# EasyEDA Pro project 1 Port AC Power Switch.eprj, schematic with Blown Fuse Detect
Board Name: V3.0.1; Create Date: 2026-05-01; Page Name: Main Page; Project Name: 1 Port AC Power Switch; Schematic Name: with Blown Fuse Detect; Update Date: 2026-05-01
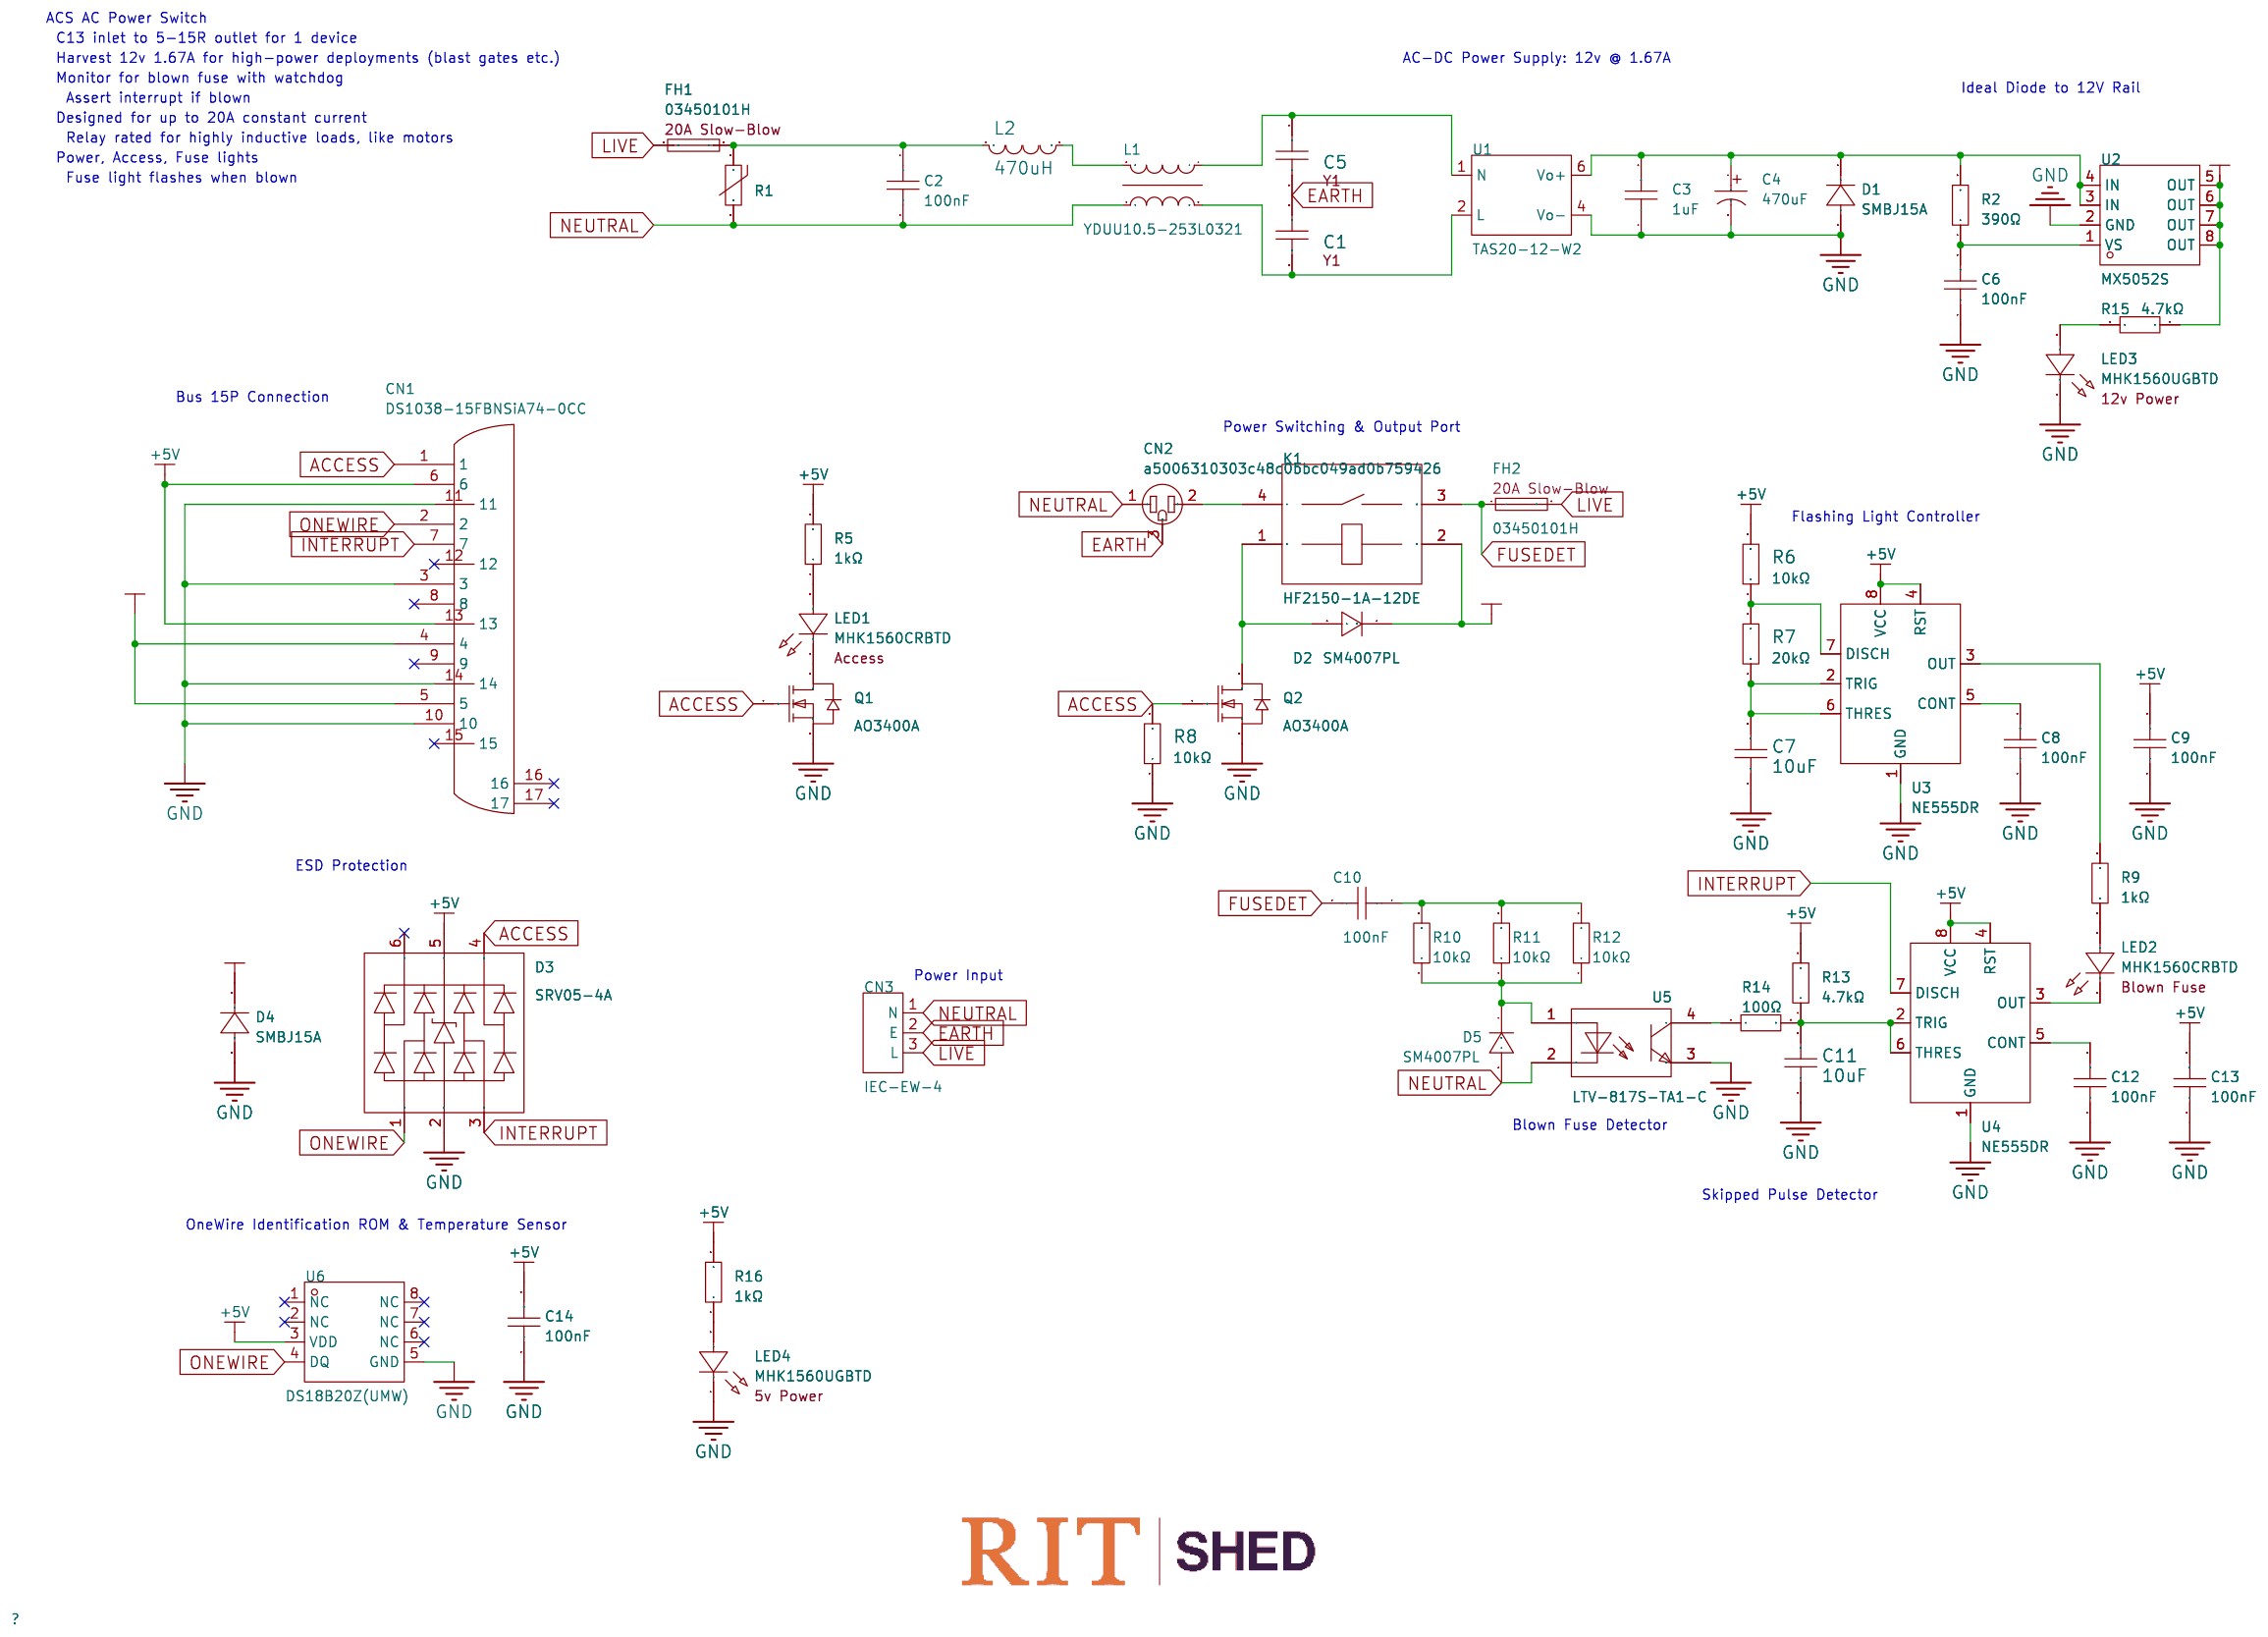
[diagram p1: schematic sheet]

## Parts
C1  1nF  [CAP-TH_L8.5-W5.0-P10.00-D0.6]
C2  100nF  [CAP-TH_L10.0-W5.0-P7.50-D0.6]
C3  1uF  [C0603]
C4  470uF  [CAP-TH_BD10.0-P5.00-D1.0-FD]
C5  1nF  [CAP-TH_L8.5-W5.0-P10.00-D0.6]
C6  100nF  [C0603]
C7  10uF  [C0603]
C8  100nF  [C0603]
C9  100nF  [C0603]
C10  100nF  [CAP-TH_L10.0-W5.0-P7.50-D0.6]
C11  10uF  [C0603]
C12  100nF  [C0603]
C13  100nF  [C0603]
C14  100nF  [C0603]
CN1  DS1038-15FBNSiA74-0CC  [DSUB-TH_DS1038-15FBNSIA74-0CC]
CN2  a5006310303c48c0bbc049ad0b759426  [739W-X2/32]
CN3  IEC-EW-4  [CONN-TH_IEC-EW-4]
D1  SMBJ15A  [SMB_L4.3-W3.6-LS5.3-RD]
D2  SM4007PL  [SOD-123F_L2.8-W1.8-LS3.7-RD]
D3  SRV05-4A  [SOT-23-6_L2.9-W1.6-P0.95-LS2.9-BL]
D4  SMBJ15A  [SMB_L4.3-W3.6-LS5.3-RD]
D5  SM4007PL  [SOD-123F_L2.8-W1.8-LS3.7-RD]
FH1  03450101H  [03450101H]
FH2  03450101H  [03450101H]
K1  HF2150-1A-12DE  [RELAY-TH_HF2150-1A]
L1  YDUU10.5-253L0321  [IND-TH_4P-L19.0-W17.0]
L2  470uH  [IND-TH_BD9.0-P5.00-D0.7]
LED1  MHK1560CRBTD  [LED-TH_MHK1560UGBTD]
LED2  MHK1560CRBTD  [LED-TH_MHK1560UGBTD]
LED3  MHK1560UGBTD  [LED-TH_MHK1560UGBTD]
LED4  MHK1560UGBTD  [LED-TH_MHK1560UGBTD]
Q1  AO3400A  [SOT-23-3_L2.9-W1.3-P1.90-LS2.4-BR]
Q2  AO3400A  [SOT-23-3_L2.9-W1.3-P1.90-LS2.4-BR]
R1  210pF@1kHz  [RES-TH_L12.5-W5.1-P7.50-D1.2-S2.20]
R2  390Ω  [R0805]
R5  1kΩ  [R0603]
R6  10kΩ  [R0603]
R7  20kΩ  [R0603]
R8  10kΩ  [R0603]
R9  1kΩ  [R0603]
R10  10kΩ  [R0805]
R11  10kΩ  [R0805]
R12  10kΩ  [R0805]
R13  4.7kΩ  [R0603]
R14  100Ω  [R0603]
R15  4.7kΩ  [R0603]
R16  1kΩ  [R0603]
U1  TAS20-12-W2  [PWRM-TH_4P-L39.0-W25.0_TAS12-15-W2]
U2  MX5052S  [SOP-8_L4.9-W3.9-P1.27-LS6.0-BL]
U3  NE555DR  [SOIC-8_L4.9-W3.9-P1.27-LS6.0-BL]
U4  NE555DR  [SOIC-8_L4.9-W3.9-P1.27-LS6.0-BL]
U5  LTV-817S-TA1-C  [OPTO-SMD-4_L4.6-W6.5-P2.54-LS10.3-BL]
U6  DS18B20Z(UMW)  [SOP-8_L4.9-W3.9-P1.27-LS6.0-BL]

## Library data of the parts
C1 C5 = VY1102M31Y5UC63V0: LCSC Part Name: 等级:X1,Y1 1nF ±20% 760V; Supplier Part: C1620957; Manufacturer: VISHAY(威世); Supplier Footprint: 插件,P=10mm; JLCPCB Part Class: Extended Part; Datasheet: https://item.szlcsc.com/datasheet/VY1102M31Y5UC63V0/1711803.html; Supplier: LCSC; Tolerance: ±20%; Voltage(AC): 760V; Ratings: Y1; Operating Temperature: -40℃~+125℃
C2 C10 = PX104K2C0702: LCSC Part Name: 等级:X2 100nF ±10% 310V 350V 380V; Supplier Part: C2693793; Manufacturer: KYET(科雅); Supplier Footprint: 插件,P=7.5mm; JLCPCB Part Class: Extended Part; Datasheet: https://item.szlcsc.com/datasheet/PX104K2C0702/2809868.html; Supplier: LCSC; Tolerance: ±10%; Voltage(AC): 310V；380V；350V; Ratings: X2; Operating Temperature: -40℃~+110℃
C3 = CL10A105KB8NNNC: LCSC Part Name: 1uF ±10% 50V; Supplier Part: C15849; Manufacturer: SAMSUNG(三星); Supplier Footprint: 0603; JLCPCB Part Class: Basic Part; Datasheet: https://item.szlcsc.com/datasheet/CL10A105KB8NNNC/16531.html; Supplier: LCSC; Tolerance: ±10%; Voltage Rating: 50V; Temperature Coefficient: X5R
C4 = KM477M025G13RR0VH2FP0: LCSC Part Name: 470uF ±20% 25V; Supplier Part: C44594; Manufacturer: Chengx(承兴); Supplier Footprint: 插件,D10xL13mm; JLCPCB Part Class: Extended Part; Datasheet: https://item.szlcsc.com/datasheet/KM477M025G13RR0VH2FP0/45596.html; Supplier: LCSC; Tolerance: ±20%; Voltage Rating: 25V; Pin Spacing: 5mm; Diameter: 10mm; Height - Seated (Max): 13mm; Lifetime: 2000hrs@105℃
C6 C8 C9 C12-C14 = CC0603KRX7R9BB104: LCSC Part Name: 100nF ±10% 50V; Supplier Part: C14663; Manufacturer: YAGEO(国巨); Supplier Footprint: 0603; Datasheet: https://item.szlcsc.com/datasheet/CC0603KRX7R9BB104/15331.html; Supplier: LCSC; Tolerance: ±10%; Voltage Rating: 50V; Temperature Coefficient: X7R
C7 C11 = CL10A106MA8NRNC: LCSC Part Name: 10uF ±20% 25V; Supplier Part: C96446; Manufacturer: SAMSUNG(三星); Supplier Footprint: 0603; Datasheet: https://item.szlcsc.com/datasheet/CL10A106MA8NRNC/97651.html; Supplier: LCSC; Tolerance: ±20%; Voltage Rating: 25V; Temperature Coefficient: X5R
CN1 = DS1038-15FBNSiA74-0CC: Connector Type:High Density D-Sub Gender:Female Number of Pins:15P Mounting Type:Right Angle Number of Rows:3 Current Rating-Signal:3A Current Rating-Power:- Voltage Rating:- Color:Black Operating Temperature:-40℃~+105℃ Operating Temperature:-40℃~+105℃; LCSC Part Name: 黑色 1000/盒 D-Sub 母 P数:15P; Supplier Part: C75754; Manufacturer: CONNFLY; Supplier Footprint: 弯插; JLCPCB Part Class: Extended Part; Datasheet: https://item.szlcsc.com/datasheet/DS1038-15FBNSiA74-0CC/76880.html; Supplier: LCSC; Connector Type: High Density D-Sub; Gender: Female; Number of Pins: 15P; Mounting Type: Right Angle; Number of Rows: 3; Current Rating-Signal: 3A; Color: Black; Operating Temperature: -40℃~+105℃
CN2 = 739W-X2/32
CN3 = IEC-EW-4: Supplier Part: C17684530; Manufacturer: ADAM TECH; Datasheet: https://item.szlcsc.com/datasheet/IEC-EW-4/18813803.html; Supplier: LCSC
D1 D4 = SMBJ15A_C19077569: LCSC Part Name: 单向TVS 15V截止 峰值浪涌电流：24.59A@10/1000us; Supplier Part: C19077569; Manufacturer: R+O(宏嘉诚); Supplier Footprint: DO-214AA(SMB); JLCPCB Part Class: Extended Part; Datasheet: https://item.szlcsc.com/datasheet/SMBJ15A/20275654.html; Supplier: LCSC; Polarity: Unidirectional; Reverse Stand-Off Voltage (Vrwm): 15V; Clamping Voltage: 24.4V; Peak Pulse Current (Ipp): 24.59A@10/1000us; Peak Pulse Power Dissipation (Ppp): 600W@10/1000us; Voltage - Breakdown: 18.5V; Reverse Leakage Current (Ir): 5uA; Operating Temperature: -55℃~+150℃; level of protection: IEC 61000-4-2; Type: TVS
D2 D5 = SM4007PL_C64898: LCSC Part Name: 1kV 1A; Supplier Part: C64898; Manufacturer: MDD(辰达半导体); Supplier Footprint: SOD-123FL; Datasheet: https://item.szlcsc.com/datasheet/SM4007PL/65968.html; Supplier: LCSC; Diode Configuration: Independent; Voltage - Forward(Vf@If): 1.1V@1A; Voltage - DC Reverse(Vr): 1kV; Current - Rectified: 1A; Reverse Leakage Current (Ir): 10uA@1kV; Non-Repetitive Peak Forward Surge Current: 25A; Operating Junction Temperature Range: -55℃~+150℃
D3 = SRV05-4A_C20615829: LCSC Part Name: 丝印:V05 单向ESD 5V截止 峰值浪涌电流：4A@8/20us; Supplier Part: C20615829; Manufacturer: R+O(宏嘉诚); Supplier Footprint: SOT-23-6L; JLCPCB Part Class: Extended Part; Datasheet: https://item.szlcsc.com/datasheet/SRV05-4A/21980004.html; Supplier: LCSC; Polarity: Unidirectional; Reverse Stand-Off Voltage (Vrwm): 5V; Clamping Voltage: 15V; Peak Pulse Current (Ipp): 4A@8/20us; Peak Pulse Power Dissipation (Ppp): 80W@8/20us; Voltage - Breakdown: 6V; Reverse Leakage Current (Ir): 5uA; Operating Temperature: -55℃~+155℃; level of protection: IEC 61000-4-5；IEC 61000-4-2; Type: ESD; Junction Capacitance: 0.5pF；1pF
FH1 FH2 = 03450101H: LCSC Part Name: 20A 600V; Supplier Part: C206934; Manufacturer: Littelfuse(美国力特); Datasheet: https://item.szlcsc.com/datasheet/03450101H/208053.html; Supplier: LCSC; Number of Circuits: 1; Voltage Rating: 600V; Current Rating: 20A; Fuse Type: Cylindrical; Fuse Diameter (φD): 6.35mm; Fuse Length: 32mm; Note: 20A Slow-Blow
K1 = HF2150-1A-12DE: LCSC Part Name: 小型大功率12V继电器 单刀单掷-常开; Supplier Part: C32863; Manufacturer: HF(宏发); Supplier Footprint: 插件,31.8x27mm; JLCPCB Part Class: Extended Part; Datasheet: https://item.szlcsc.com/datasheet/HF2150-1A-12DE/33828.html; Supplier: LCSC; Coil Voltage: 12V; Contact Form: 1 Set Normally Open: 1A (SPST NO); Number of Pins: 5; Contact Rating: 30A@240VAC；20A@30VDC; Switching Voltage(Max): 277V@AC；30V@DC; Coil Rated Power: 900mW; Contact Material: AgCdO; Switching Current(Max): 40A; Coil Type: Non-Polarized - Single Coil; Coil Resistance: 155Ω; Contact Resistance: 50mΩ; Operate Time: 15ms; Release Time: 10ms; Operating Temperature: -55℃~+85℃
L1 = YDUU10.5-253L0321: LCSC Part Name: UU10.5 25mH @1KHz; Supplier Part: C5200263; Manufacturer: YJYCOIN(益嘉源); Supplier Footprint: 插件,19x17mm; JLCPCB Part Class: Extended Part; Datasheet: https://item.szlcsc.com/datasheet/YDUU10.5-253L0321/5887401.html; Supplier: LCSC; Number of Lines: 2; Inductance @ Frequency: 25mH@1KHz; Voltage Withstand: 1.5kV@AC
L2 = PK0810-471MB: LCSC Part Name: 470uH ±20%; Supplier Part: C400319; Manufacturer: SXN(顺翔诺); Supplier Footprint: 插件,D10xL13mm; JLCPCB Part Class: Extended Part; Datasheet: https://item.szlcsc.com/datasheet/PK0810-471MB/384150.html; Supplier: LCSC; Tolerance: ±20%; Current Rating: 420mA; DC Resistance(DCR): 800mΩ; Type: Unshielded Inductor
LED1 = MHK1560CRBTD: LCSC Part Name: 1560直插单灯红色光; Supplier Part: C7470835; Manufacturer: MEIHUA(美华); Supplier Footprint: 插件,P=2.54mm; JLCPCB Part Class: Extended Part; Datasheet: https://item.szlcsc.com/datasheet/MHK1560CRBTD/8521940.html; Supplier: LCSC; Illumination Color: Red; Voltage - Forward(Vf): 1.75V~2.2V; Power(Watts): 80mW; Forward Current: 20mA; Wavelength - Dominant: 632nm; Lens Color: Diffused Red Lens; Luminous Intensity: 50mcd; Viewing Angle: 85°; Operating Temperature: -40℃~+85℃; Note: Access
LED2 = MHK1560CRBTD: LCSC Part Name: 1560直插单灯红色光; Supplier Part: C7470835; Manufacturer: MEIHUA(美华); Supplier Footprint: 插件,P=2.54mm; JLCPCB Part Class: Extended Part; Datasheet: https://item.szlcsc.com/datasheet/MHK1560CRBTD/8521940.html; Supplier: LCSC; Illumination Color: Red; Voltage - Forward(Vf): 1.75V~2.2V; Power(Watts): 80mW; Forward Current: 20mA; Wavelength - Dominant: 632nm; Lens Color: Diffused Red Lens; Luminous Intensity: 50mcd; Viewing Angle: 85°; Operating Temperature: -40℃~+85℃; Note: Blown Fuse
LED3 = MHK1560UGBTD: Emitted Color:Emerald Forward Voltage (VF):1.75V~2.2V Forward Voltage (VF):1.75V~2.2V Forward Current:20mA Dominant Wavelength:520nm Dominant Wavelength:520nm Lens Color:雾状绿透镜 Luminous Intensity:1000mcd Luminous Intensity:1000mcd Viewing Angle:85° Operati; LCSC Part Name: 1560直插单灯翠绿色光; Supplier Part: C7470833; Manufacturer: MEIHUA(美华); Supplier Footprint: 插件,P=2.54mm; JLCPCB Part Class: Extended Part; Datasheet: https://atta.szlcsc.com/upload/public/pdf/source/20231114/0151DB1F997DCF286213A722D08B4BAA.pdf; Supplier: LCSC; Emitted Color: Emerald; Forward Voltage (VF): 1.75V~2.2V; Forward Current: 20mA; Dominant Wavelength: 520nm; Lens Color: 雾状绿透镜; Luminous Intensity: 1000mcd; Viewing Angle: 85°; Operating Temperature: -40℃~+85℃; Note: 12v Power
LED4 = MHK1560UGBTD: Emitted Color:Emerald Forward Voltage (VF):1.75V~2.2V Forward Voltage (VF):1.75V~2.2V Forward Current:20mA Dominant Wavelength:520nm Dominant Wavelength:520nm Lens Color:雾状绿透镜 Luminous Intensity:1000mcd Luminous Intensity:1000mcd Viewing Angle:85° Operati; LCSC Part Name: 1560直插单灯翠绿色光; Supplier Part: C7470833; Manufacturer: MEIHUA(美华); Supplier Footprint: 插件,P=2.54mm; JLCPCB Part Class: Extended Part; Datasheet: https://atta.szlcsc.com/upload/public/pdf/source/20231114/0151DB1F997DCF286213A722D08B4BAA.pdf; Supplier: LCSC; Emitted Color: Emerald; Forward Voltage (VF): 1.75V~2.2V; Forward Current: 20mA; Dominant Wavelength: 520nm; Lens Color: 雾状绿透镜; Luminous Intensity: 1000mcd; Viewing Angle: 85°; Operating Temperature: -40℃~+85℃; Note: 5v Power
Q1 Q2 = AO3400A_C20917: LCSC Part Name: 1个N沟道 耐压:30V 电流:5.7A; Supplier Part: C20917; Manufacturer: AOS; Supplier Footprint: SOT-23-3L; Datasheet: https://item.szlcsc.com/datasheet/AO3400A/21629.html; Supplier: LCSC; Drain to Source Voltage: 30V; RDS(on): 48mΩ@2.5V; Gate Threshold Voltage (Vgs(th)): 1.45V@250uA; Gate Charge(Qg): 7nC@10V; Input Capacitance(Ciss): 630pF@15V; Operating Temperature: -55℃~+150℃@(Tj); Type: N-Channel
R1 = VDR-10D471K: LCSC Part Name: 钳位电压775V 67焦耳 插件压敏电阻; Supplier Part: C316609; Manufacturer: VDR(嵩隆); Supplier Footprint: 插件,P=7.5mm; JLCPCB Part Class: Extended Part; Datasheet: https://item.szlcsc.com/datasheet/VDR-10D471K/298277.html; Supplier: LCSC; Varistor Voltage: 423V~517V; Clamping Voltage: 775V; Maximum DC Volts: 385V; Maximum AC Volts: 300V; Peak Current: 2.5kA; Energy: 67J; Rated Wattage: 400mW
R2 = 0805W8F3900T5E: Type:Thick Film Resistor Resistance:390Ω Tolerance:±1% Tolerance:±1% Power(Watts):125mW Voltage-Supply(Max):150V Temperature Coefficient:±100ppm/℃ Temperature Coefficient:±100ppm/℃ Operating Temperature:-55℃~+155℃ Operating Temperature:-55℃~+155℃; LCSC Part Name: 390Ω ±1% 125mW 厚膜电阻; Supplier Part: C17655; Manufacturer: UNI-ROYAL(厚声); Supplier Footprint: 0805; Datasheet: https://item.szlcsc.com/datasheet/0805W8F3900T5E/18343.html; Supplier: LCSC; Type: Thick Film Resistor; Tolerance: ±1%; Power(Watts): 125mW; Voltage-Supply(Max): 150V; Temperature Coefficient: ±100ppm/℃; Operating Temperature: -55℃~+155℃
R5 R9 R16 = 0603WAF1001T5E: LCSC Part Name: 1kΩ ±1% 100mW 厚膜电阻; Supplier Part: C21190; Manufacturer: UNI-ROYAL(厚声); Supplier Footprint: 0603; Datasheet: https://item.szlcsc.com/datasheet/0603WAF1001T5E/21904.html; Supplier: LCSC; Type: Thick Film Resistor; Tolerance: ±1%; Power(Watts): 100mW; Voltage-Supply(Max): 75V; Temperature Coefficient: ±100ppm/℃; Operating Temperature: -55℃~+155℃
R6 R8 = 0603WAF1002T5E: LCSC Part Name: 厚膜电阻 10kΩ ±1% 100mW; Supplier Part: C25804; Manufacturer: UNI-ROYAL(厚声); Supplier Footprint: 0603; JLCPCB Part Class: Basic Part; Datasheet: https://item.szlcsc.com/datasheet/0603WAF1002T5E/26547.html; Supplier: LCSC; Type: Thick Film Resistor; Tolerance: ±1%; Power(Watts): 100mW; Voltage-Supply(Max): 75V; Temperature Coefficient: ±100ppm/℃; Operating Temperature: -55℃~+155℃
R7 = 0603WAF2002T5E: LCSC Part Name: 20kΩ ±1% 100mW 厚膜电阻; Supplier Part: C4184; Manufacturer: UNI-ROYAL(厚声); Supplier Footprint: 0603; Datasheet: https://item.szlcsc.com/datasheet/0603WAF2002T5E/4591.html; Supplier: LCSC; Type: Thick Film Resistor; Tolerance: ±1%; Power(Watts): 100mW; Voltage-Supply(Max): 75V; Temperature Coefficient: ±100ppm/℃; Operating Temperature: -55℃~+155℃
R10-R12 = 0805W8F1002T5E: LCSC Part Name: 10kΩ ±1% 125mW 厚膜电阻; Supplier Part: C17414; Manufacturer: UNI-ROYAL(厚声); Supplier Footprint: 0805; JLCPCB Part Class: Basic Part; Datasheet: https://item.szlcsc.com/datasheet/0805W8F1002T5E/18102.html; Supplier: LCSC; Type: Thick Film Resistor; Tolerance: ±1%; Power(Watts): 125mW; Voltage-Supply(Max): 150V; Temperature Coefficient: ±100ppm/℃; Operating Temperature: -55℃~+155℃
R13 R15 = 0603WAF4701T5E: LCSC Part Name: 4.7kΩ ±1% 100mW 厚膜电阻; Supplier Part: C23162; Manufacturer: UNI-ROYAL(厚声); Supplier Footprint: 0603; Datasheet: https://item.szlcsc.com/datasheet/0603WAF4701T5E/23889.html; Supplier: LCSC; Type: Thick Film Resistor; Tolerance: ±1%; Power(Watts): 100mW; Voltage-Supply(Max): 75V; Temperature Coefficient: ±100ppm/℃; Operating Temperature: -55℃~+155℃
R14 = 0603WAF1000T5E: LCSC Part Name: 100Ω ±1% 100mW 厚膜电阻; Supplier Part: C22775; Manufacturer: UNI-ROYAL(厚声); Supplier Footprint: 0603; Datasheet: https://atta.szlcsc.com/upload/public/pdf/source/20200306/C422600_1E6D84923E4A46A82E41ADD87F860B5C.pdf; Supplier: LCSC; Type: Thick Film Resistors; Tolerance: ±1%; Temperature Coefficient: ±200ppm/℃; Operating Temperature Range: -55℃~+155℃
U1 = TAS20-12-W2: LCSC Part Name: 小体积AC-DC电源模块; Supplier Part: C39846906; Manufacturer: TDPOWER(腾达电源); Supplier Footprint: 插件,39x25mm; JLCPCB Part Class: Extended Part; Datasheet: https://item.szlcsc.com/datasheet/TAS20-12-W2/41578643.html; Supplier: LCSC; Conversion Type: AC/DC-DC; Number of Outputs: 1; Voltage - Input(DC): 100V~370V; Voltage - Input(AC): 85VAC~265VAC; Output Voltage: 12V; Output Voltage Accuracy: ±2%; Output Current(Max): 1.67A; Output Power: 20W; Quiescent Dissipation: 0.15W; Conversion Efficiency: 88%; Ripple Noise: 100mVp-p; Capacitive Load(Max): 3300uF; Features: Over Current Protection；Short Circuit Protection; Isolation Voltage(Vrms): 2.5kV; Length: 39mm; Width: 25mm; Height: 21mm; Switching Frequency: 100kHz
U2 = MX5052S: LCSC Part Name: 集成MOS Oring控制器; Supplier Part: C5875696; Manufacturer: Wuxi Maxinmicro(无锡明芯微); Supplier Footprint: SOP-8; JLCPCB Part Class: Extended Part; Datasheet: https://item.szlcsc.com/datasheet/MX5052S/6809525.html; Supplier: LCSC
U3 U4 = NE555DR: Supplier Part: C7593; Manufacturer: TI(德州仪器); Supplier Footprint: SOIC-8; Datasheet: https://www.ti.com/cn/lit/gpn/sa555; Supplier: LCSC
U5 = LTV-817S-TA1-C: LCSC Part Name: DC输入 隔离电压(rms):5000V; Supplier Part: C109227; Manufacturer: LITEON(光宝); Supplier Footprint: SMD-4P; Datasheet: https://item.szlcsc.com/datasheet/LTV-817S-TA1-C/110448.html; Supplier: LCSC; Input type: DC; Output Type: Phototransistor; Voltage - Forward(Vf): 1.2V; Output Current: 50mA; Isolation Voltage(Vrms): 5kV; Reverse Voltage: 6V; Load Voltage: 35V; Number of Outputs: 1; Vce Saturation(VCE(sat)): 100mV@1mA,20mA; Rise time: 4us@2mA,100Ω; Fall time: 3us; Operating Temperature: -30℃~+110℃; Current Transfer Ratio (CTR) Minimum: 50%; Current Transfer Ratio (CTR) Maximum/Saturation Value: 600%; Forward Current(If): 50mA
U6 = DS18B20Z(UMW): LCSC Part Name: 温度传感器; Supplier Part: C695837; Manufacturer: UMW(友台半导体); Supplier Footprint: SOIC-8; JLCPCB Part Class: Extended Part; Datasheet: https://atta.szlcsc.com/upload/public/pdf/source/20241210/329D6A12FB6ADF2EBB286F6D44242ED4.pdf; Supplier: LCSC; Resolution: ±0.4℃; Supply Voltage: 2.5V~5.5V

## Nets
+5V: C9.2 C13.2 C14.2 CN1.6 CN1.13 D3.5(VP) R5.2 R6.2 R13.2 R16.2 U3.4(RST) U3.8(VCC) U4.4(RST) U4.8(VCC) U6.3(VDD)
+12V: CN1.4 CN1.5 D2.1(C) D4.1(K) K1.2 R15.1 U2.5(OUT) U2.6(OUT) U2.7(OUT) U2.8(OUT)
GND: C3.1 C4.2 C6.1 C7.1 C8.1 C9.1 C11.1 C12.1 C13.1 C14.1 CN1.3 CN1.10 CN1.11 CN1.14 D1.2(A) D3.2(VN) D4.2(A) LED3.1(K) LED4.1(K) Q1.2(S) Q2.2(S) R8.1 U1.4(Vo-) U2.2(GND) U3.1(GND) U4.1(GND) U5.3 U6.5(GND)
ACCESS: CN1.1 D3.4(I/O) Q1.1(G) Q2.1(G) R8.2
EARTH: C1.1 C5.2 CN2.3 CN3.2(E)
FUSEDET: C10.2 FH2.1 K1.3
INTERRUPT: CN1.7 D3.3(I/O) U4.7(DISCH)
LIVE: CN3.3(L) FH1.2 FH2.2
NEUTRAL: C2.2 CN2.1 CN3.1(N) D5.2(A) L1.1 R1.2 U5.2
ONEWIRE: CN1.2 D3.1(I/O) U6.4(DQ)
$1N351: CN2.2 K1.4
$1N604: D5.1(C) R10.1 R11.1 R12.1 U5.1
$1N729: R14.1 U5.4
$1N819: C11.2 R13.1 R14.2 U4.2(TRIG) U4.6(THRES)
$1N1030: C12.2 U4.5(CONT)
$1N1211: LED2.2(A) R9.1
$1N1254: LED2.1(K) U4.3(OUT)
$1N1384: R9.2 U3.3(OUT)
$1N1437: C8.2 U3.5(CONT)
$1N1554: C7.2 R7.1 U3.2(TRIG) U3.6(THRES)
$1N1596: R6.1 R7.2 U3.7(DISCH)
$1N1792: D2.2(A) K1.1 Q2.3(D)
$1N3074: C1.2 L1.3 U1.2(L)
$1N3080: C5.1 L1.4 U1.1(N)
$1N3148: C3.2 C4.1 D1.1(K) R2.2 U1.6(Vo+) U2.3(IN) U2.4(IN)
$1N3585: C6.2 R2.1 U2.1(VS)
$1N4288: LED1.2(A) R5.1
$1N4486: LED1.1(K) Q1.3(D)
$1N13836: C10.1 R10.2 R11.2 R12.2
$1N20815: C2.1 FH1.1 L2.1 R1.1
$1N20816: L1.2 L2.2
$1N22595: LED3.2(A) R15.2
$1N22684: LED4.2(A) R16.1

Not connected (* = marked no-connect by the designer): CN1 8* 9* 12* 15* 16* 17*; D3 6(I/O)*; U6 1(NC)* 2(NC)* 6(NC)* 7(NC)* 8(NC)*

## Notes on the sheet
- ACS AC Power Switch
- C13 inlet to 5-15R outlet for 1 device
- Harvest 12v 1.67A for high-power deployments (blast gates etc.)
- AC-DC Power Supply: 12v @ 1.67A
- Monitor for blown fuse with watchdog
- Ideal Diode to 12V Rail
- Assert interrupt if blown
- Designed for up to 20A constant current
- Power, Access, Fuse lights
- Relay rated for highly inductive loads, like motors
- Fuse light flashes when blown
- Bus 15P Connection
- Power Switching & Output Port
- Flashing Light Controller
- ESD Protection
- Power Input
- Blown Fuse Detector
- Skipped Pulse Detector
- OneWire Identification ROM & Temperature Sensor
